# Altium schematic sheet Main.SchDoc
size A4
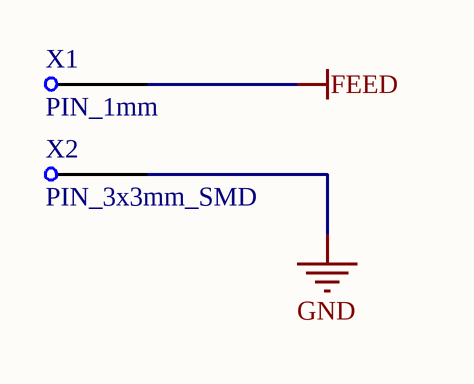
[diagram p0: Main.SchDoc]

## Parts
X1  PIN_1mm  [PIN_1mm]
X2  PIN_3x3mm_SMD  [PIN_3x3mm_SMD]

## Nets
FEED: X1.1
GND: X2.1